# Altium schematic sheet micro-ATMEGA32M1.SchDoc
size A4; DocumentNumber: 2; SheetNumber: 2; SheetTotal: 11
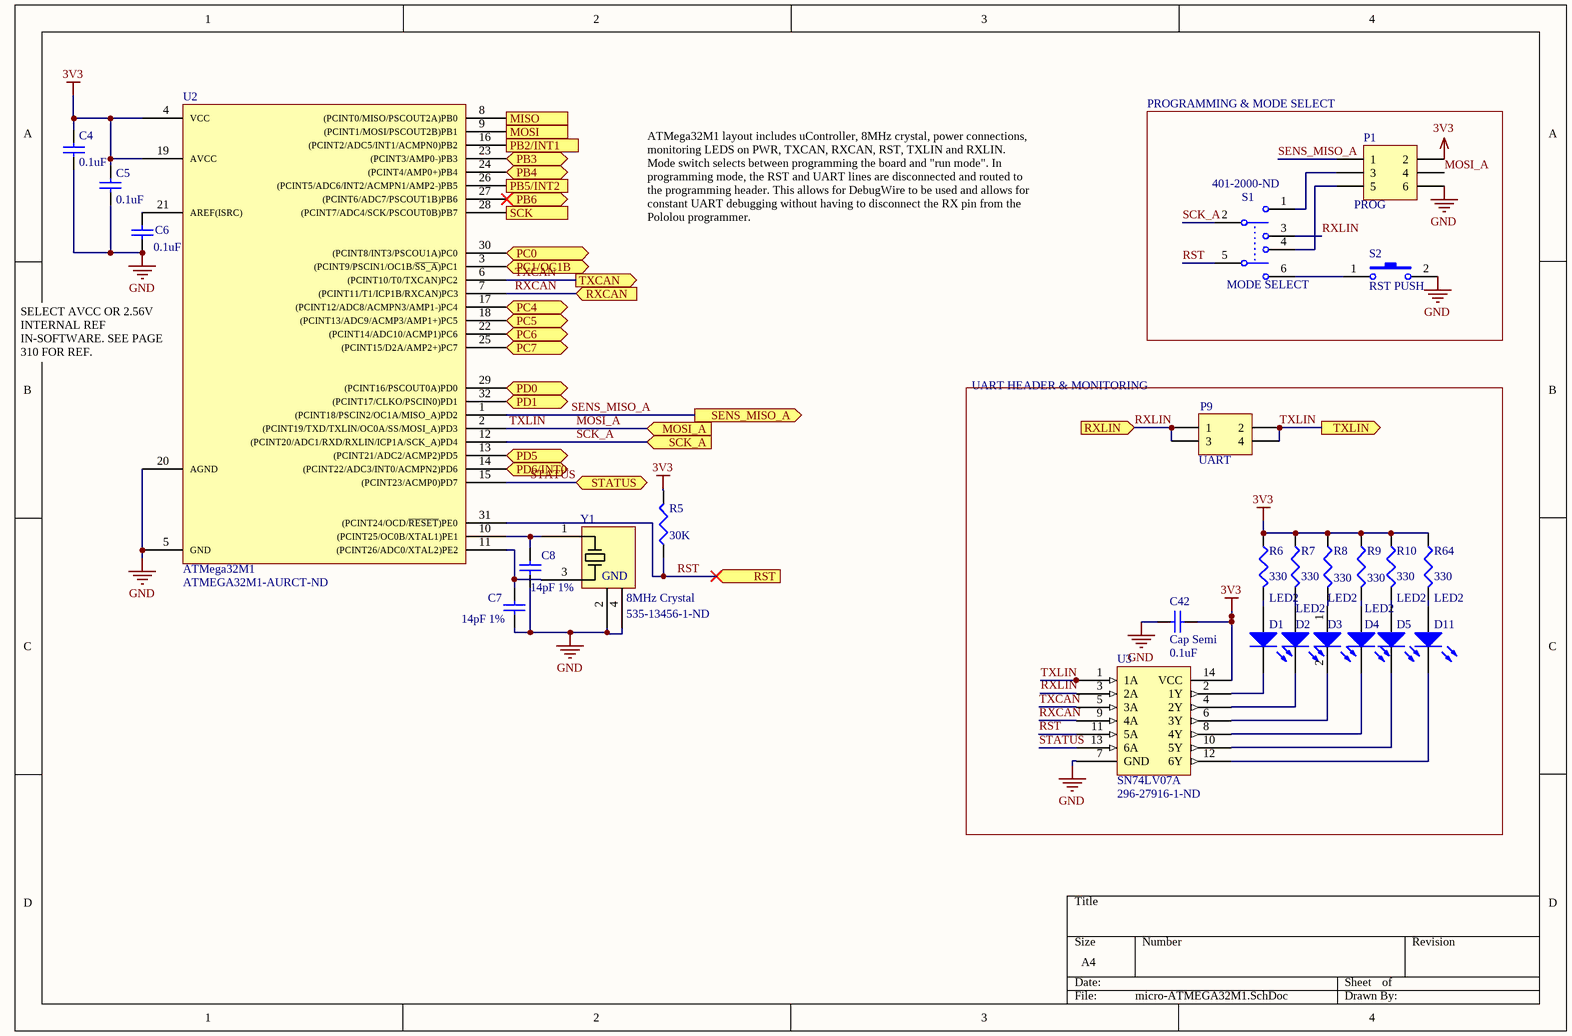
[diagram p0: micro-ATMEGA32M1.SchDoc]

## Parts
C4  0.1uF  [1608[0603]]
C5  0.1uF  [1608[0603]]
C6  0.1uF  [1608[0603]]
C7  value 14pF 1%  [1608[0603]]  (hidden comment: 15pF 1%)
C8  value 14pF 1%  [1608[0603]]  (hidden comment: 15pF 1%)
C42  Cap Semi  value 0.1uF  [1608[0603]]
D1  LED2  [0603-LED]
D2  LED2  [0603-LED]
D3  LED2  [0603-LED]
D4  LED2  [0603-LED]
D5  LED2  [0603-LED]
D11  LED2  [0603-LED]
P1  PROG  [HDR2X3]
P9  UART  [HDR2X2]
R5  30K  [J1-0603]
R6  330  [J1-0603]
R7  330  [J1-0603]
R8  330  [J1-0603]
R9  330  [J1-0603]
R10  330  [J1-0603]
R64  330  [J1-0603]
S1  MODE SELECT  Supplier Part Number: 401-2000-ND  [DPST_32m1_switch]
S2  RST PUSH  [Pushbutton]
U2  ATMega32M1  Supplier Part Number 1: ATMEGA32M1-AURCT-ND  [QFP80P900X900X120-32N]
U3  SN74LV07A  Supplier Part Number: 296-27916-1-ND  [SOP65P640X120-14N]
Y1  8MHz Crystal  Supplier Part Number 1: 535-13456-1-ND  [OSCSC500X320X110-4N]

## Blocks framed on the sheet
PROGRAMMING & MODE SELECT: P1 S1 S2
UART HEADER & MONITORING: C42 D1-D5 D11 P9 R6-R10 R64 U3

## Ports
MISO (in), MOSI (out), MOSI_A (in), PB2/INT1 (in), PB3 (bidir), PB4 (bidir), PB5/INT2 (in), PB6 (bidir), PC0 (bidir), PC1/OC1B (bidir), PC4 (bidir), PC5 (bidir), PC6 (bidir), PC7 (bidir), PD0 (bidir), PD1 (bidir), PD5 (bidir), PD6/INT0 (bidir), RST (in), RXCAN (in), RXLIN (in), SCK (out), SCK_A (in), SENS_MISO_A (out), STATUS (bidir), TXCAN (out), TXLIN (out)

## Nets
3V3: C4.2 C5.2 C42.2 P1.2 R5.2 R6.1 R7.1 R8.1 R9.1 R10.1 R64.1 U2.4(VCC) U2.19(AVCC) U3.14(VCC)
GND: C4.1 C5.1 C6.2 C7.1 C8.1 C42.1 P1.6 S2.2 U2.5(GND) U2.20(AGND) U3.7(GND) Y1.2 Y1.4
MISO: U2.8((PCINT0/MISO/PSCOUT2A)PB0) ; port MISO
MOSI: U2.9((PCINT1/MOSI/PSCOUT2B)PB1) ; port MOSI
MOSI_A: P1.4 P9.2 P9.4 U2.2((PCINT19/TXD/TXLIN/OC0A/SS/MOSI_A)PD3) U3.1(1A) ; port TXLIN, port MOSI_A  [also labelled TXLIN]
PB2/INT1: U2.16((PCINT2/ADC5/INT1/ACMPN0)PB2) ; port PB2/INT1
PB3: U2.23((PCINT3/AMP0-)PB3) ; port PB3
PB4: U2.24((PCINT4/AMP0+)PB4) ; port PB4
PB5/INT2: U2.26((PCINT5/ADC6/INT2/ACMPN1/AMP2-)PB5) ; port PB5/INT2
PB6: U2.27((PCINT6/ADC7/PSCOUT1B)PB6) ; port PB6
PC0: U2.30((PCINT8/INT3/PSCOU1A)PC0) ; port PC0
PC1/OC1B: U2.3((PCINT9/PSCIN1/OC1B/~{SS_A})PC1) ; port PC1/OC1B
PC4: U2.17((PCINT12/ADC8/ACMPN3/AMP1-)PC4) ; port PC4
PC5: U2.18((PCINT13/ADC9/ACMP3/AMP1+)PC5) ; port PC5
PC6: U2.22((PCINT14/ADC10/ACMP1)PC6) ; port PC6
PC7: U2.25((PCINT15/D2A/AMP2+)PC7) ; port PC7
PD0: U2.29((PCINT16/PSCOUT0A)PD0) ; port PD0
PD1: U2.32((PCINT17/CLKO/PSCIN0)PD1) ; port PD1
PD5: U2.13((PCINT21/ADC2/ACMP2)PD5) ; port PD5
PD6/INT0: U2.14((PCINT22/ADC3/INT0/ACMPN2)PD6) ; port PD6/INT0
RST: R5.1 S1.5 U2.31((PCINT24/OCD/~{RESET})PE0) U3.11(5A) ; port RST
RXCAN: U2.7((PCINT11/T1/ICP1B/RXCAN)PC3) U3.9(4A) ; port RXCAN
RXLIN: P9.1 P9.3 S1.3 U3.3(2A) ; port RXLIN
SCK: U2.28((PCINT7/ADC4/SCK/PSCOUT0B)PB7) ; port SCK
SCK_A: S1.2 U2.12((PCINT20/ADC1/RXD/RXLIN/ICP1A/SCK_A)PD4) ; port SCK_A
SENS_MISO_A: P1.1 U2.1((PCINT18/PSCIN2/OC1A/MISO_A)PD2) ; port SENS_MISO_A
STATUS: U2.15((PCINT23/ACMP0)PD7) U3.13(6A) ; port STATUS
TXCAN: U2.6((PCINT10/T0/TXCAN)PC2) U3.5(3A) ; port TXCAN
NetC6_1: C6.1 U2.21(AREF(ISRC))
NetC7_2: C7.2 U2.11((PCINT26/ADC0/XTAL2)PE2) Y1.3(IN)
NetC8_2: C8.2 U2.10((PCINT25/OC0B/XTAL1)PE1) Y1.1(IN)
NetD1_1: D1.1(A) R6.2
NetD1_2: D1.2(K) U3.2(1Y)
NetD2_1: D2.1(A) R7.2
NetD2_2: D2.2(K) U3.4(2Y)
NetD3_1: D3.1(A) R8.2
NetD3_2: D3.2(K) U3.6(3Y)
NetD4_1: D4.1(A) R9.2
NetD4_2: D4.2(K) U3.8(4Y)
NetD5_1: D5.1(A) R10.2
NetD5_2: D5.2(K) U3.10(5Y)
NetD11_1: D11.1(A) R64.2
NetD11_2: D11.2(K) U3.12(6Y)
NetP1_3: P1.3 S1.1
NetP1_5: P1.5 S1.4
NetS1_6: S1.6 S2.1

## Notes on the sheet
- ATMega32M1 layout includes uController, 8MHz crystal, power connections, monitoring LEDS on PWR, TXCAN, RXCAN, RST, TXLIN and RXLIN. Mode switch selects between programming the board and "run mode". In programming mode, the RST and UART lines are disconnected and routed to the programming header. This allows for DebugWire to be used and allows for constant UART debugging without having to disconnect the RX pin from the Pololou programmer.
- (near U2) SELECT AVCC OR 2.56V INTERNAL REF IN-SOFTWARE. SEE PAGE 310 FOR REF.
- (in symbol 8MHz Abracom 4-Pin Crystal) GND

## Library data of the parts
C4-C8 C42 = Cap Semi: Capacitor (Semiconductor SIM Model); Published: 8-Jun-2000; LatestRevisionDate: 29-May-2009; LatestRevisionNote: IPC-7351 Footprint Added.; PackageReference: C1206; Publisher: Altium Limited; PackageDescription: Chip Capacitor
  C4-C6: Value: 0.1uF; Supplier: Digi-Key; Supplier Part Number: 587-3807-1-ND
  C7 C8: Supplier: Digi-Key; Supplier Part Number: 490-16416-1-ND
D1-D5 D11 = LED2: Typical RED, GREEN, YELLOW, AMBER GaAs LED; Published: 8-Jun-2000; LatestRevisionDate: 17-Jul-2002; LatestRevisionNote: Re-released for DXP Platform.; PackageVersion: Feb-2002; PackageReference: 3.2X1.6X1.1; Publisher: Altium Limited; PackageDescription: SM LED; 2 Flat Leads; Supplier: Digi-Key
P1 = Header 3X2: Header, 3-Pin, Dual row; LatestRevisionDate: 17-Jul-2002; LatestRevisionNote: Re-released for DXP Platform.; Publisher: Altium Limited; Supplier: Digi-Key
P9 = Header 2X2: Header, 2-Pin, Dual row; LatestRevisionDate: 17-Jul-2002; LatestRevisionNote: Re-released for DXP Platform.; Publisher: Altium Limited; Supplier: Digi-Key
R5-R10 R64 = Res3: Resistor; Published: 8-Jun-2000; LatestRevisionDate: 29-May-2009; LatestRevisionNote: IPC-7351 Footprint Added.; PackageReference: J1-0603; Publisher: Altium Limited; PackageDescription: Chip Resistor; Supplier: Digi-Key
  R5: Value: 30K
  R6-R10 R64: Value: 330
S1 = SW-DPDT: Double-Pole, Double-Throw Switch; Published: 24-Mar-1999; LatestRevisionDate: 17-Jul-2002; LatestRevisionNote: Re-released for DXP Platform.; PackageReference: DPDT-6; Publisher: Altium Limited; PackageDescription: Switch; 6 Leads; Supplier: Digi-Key
S2 = SW-PB: Switch; Published: 24-Mar-1999; LatestRevisionDate: 17-Jul-2002; LatestRevisionNote: Re-released for DXP Platform.; PackageReference: SPST-2; Publisher: Altium Limited; PackageDescription: Switch; 2 Leads; Supplier: Digi-Key; Supplier Part Number: CKN10587CT-ND
U2 = ATMega32M1: Atmel 8-bit AVR microcontroller.; Supplier 1: Digi-Key; Supplier: Digi-Key
U3 = SN74LV07A: Six element 1-bit non-inverting open-drain buffer.; Supplier: Digi-Key
Y1 = 8MHz Abracom 4-Pin Crystal: 8MHz Abracom 4-pin crystal.; Supplier 1: Digi-Key